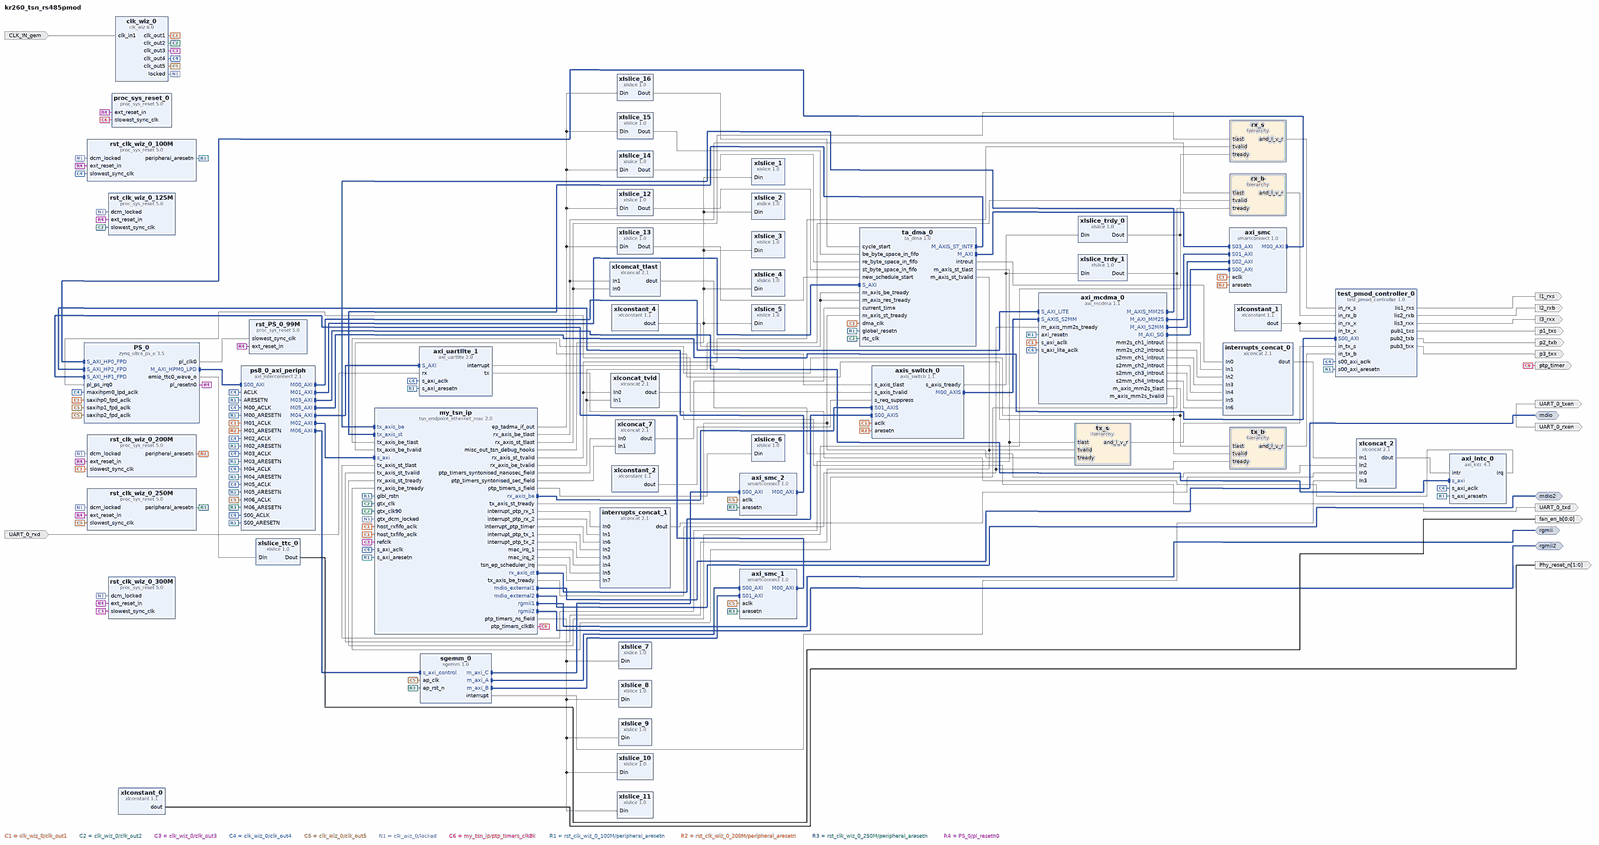
[diagram p0: block diagram of the top level, whole]
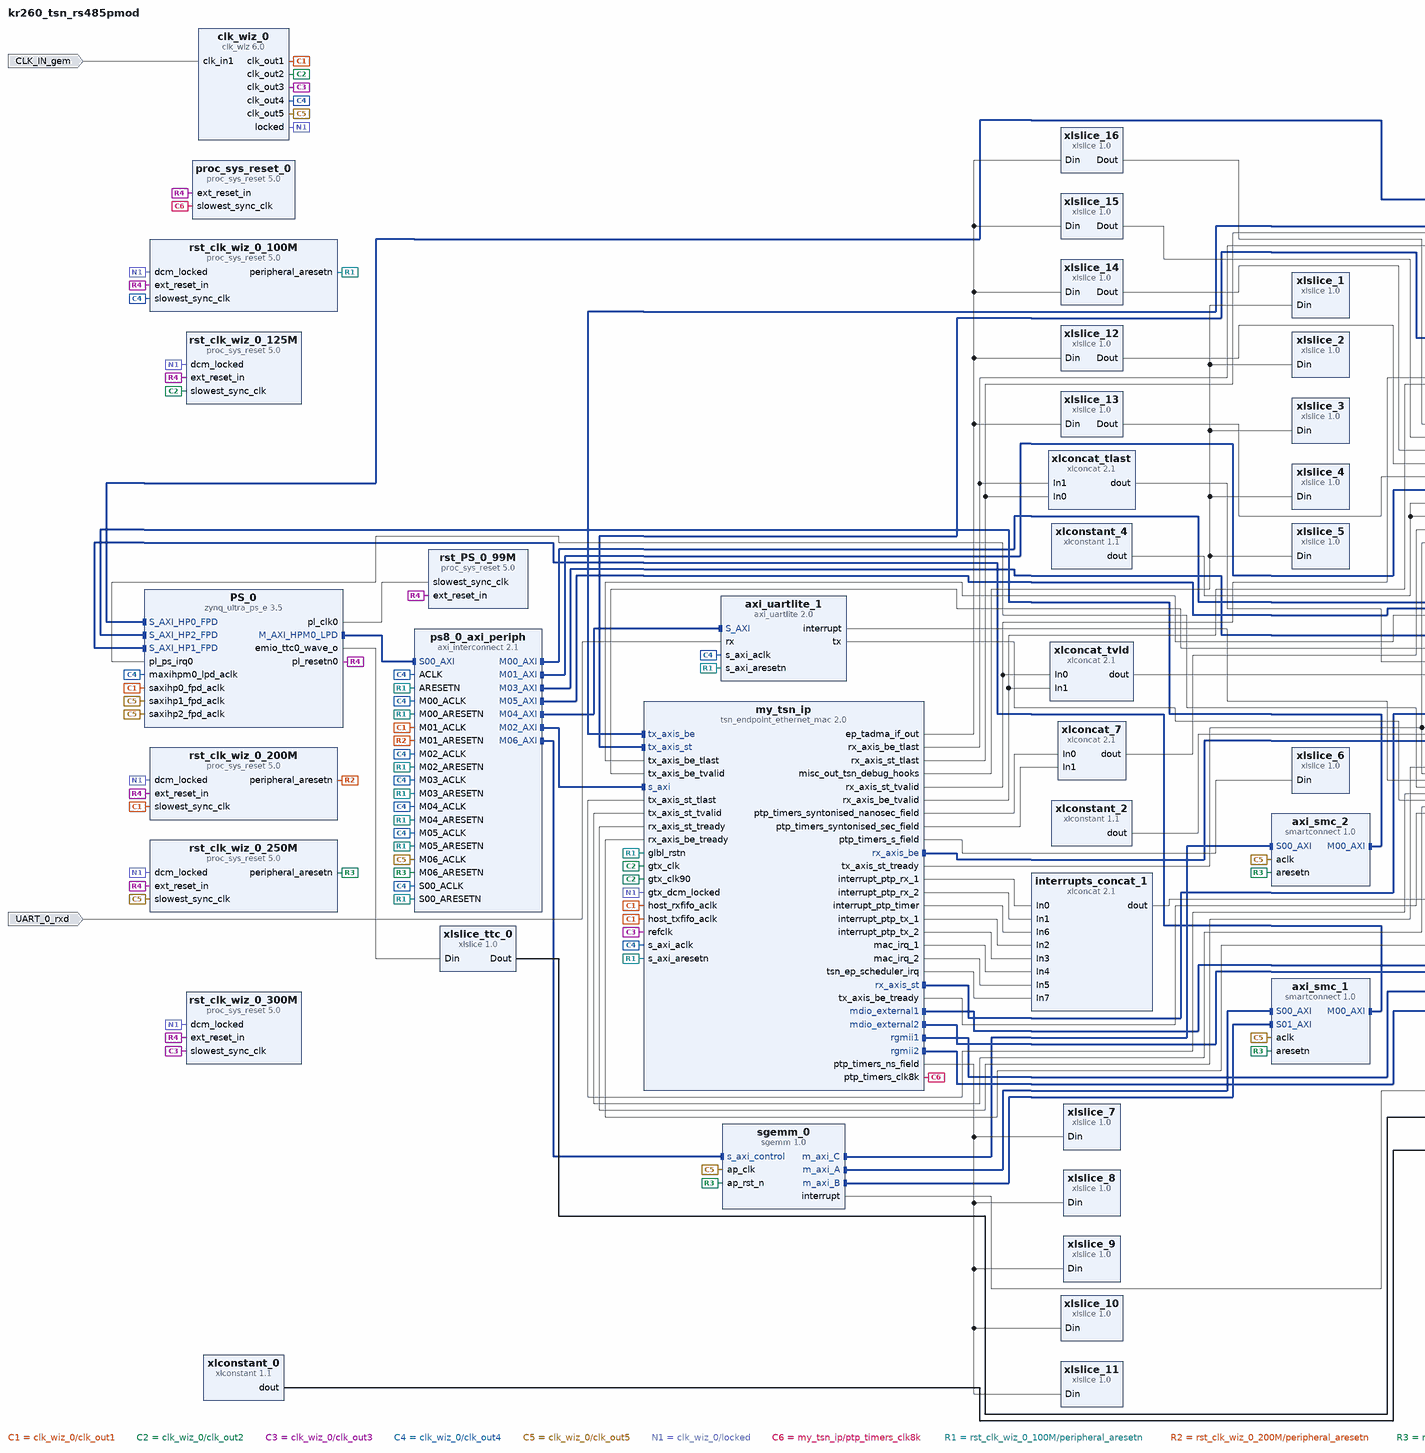
[diagram p1: block diagram of the top level, left part]
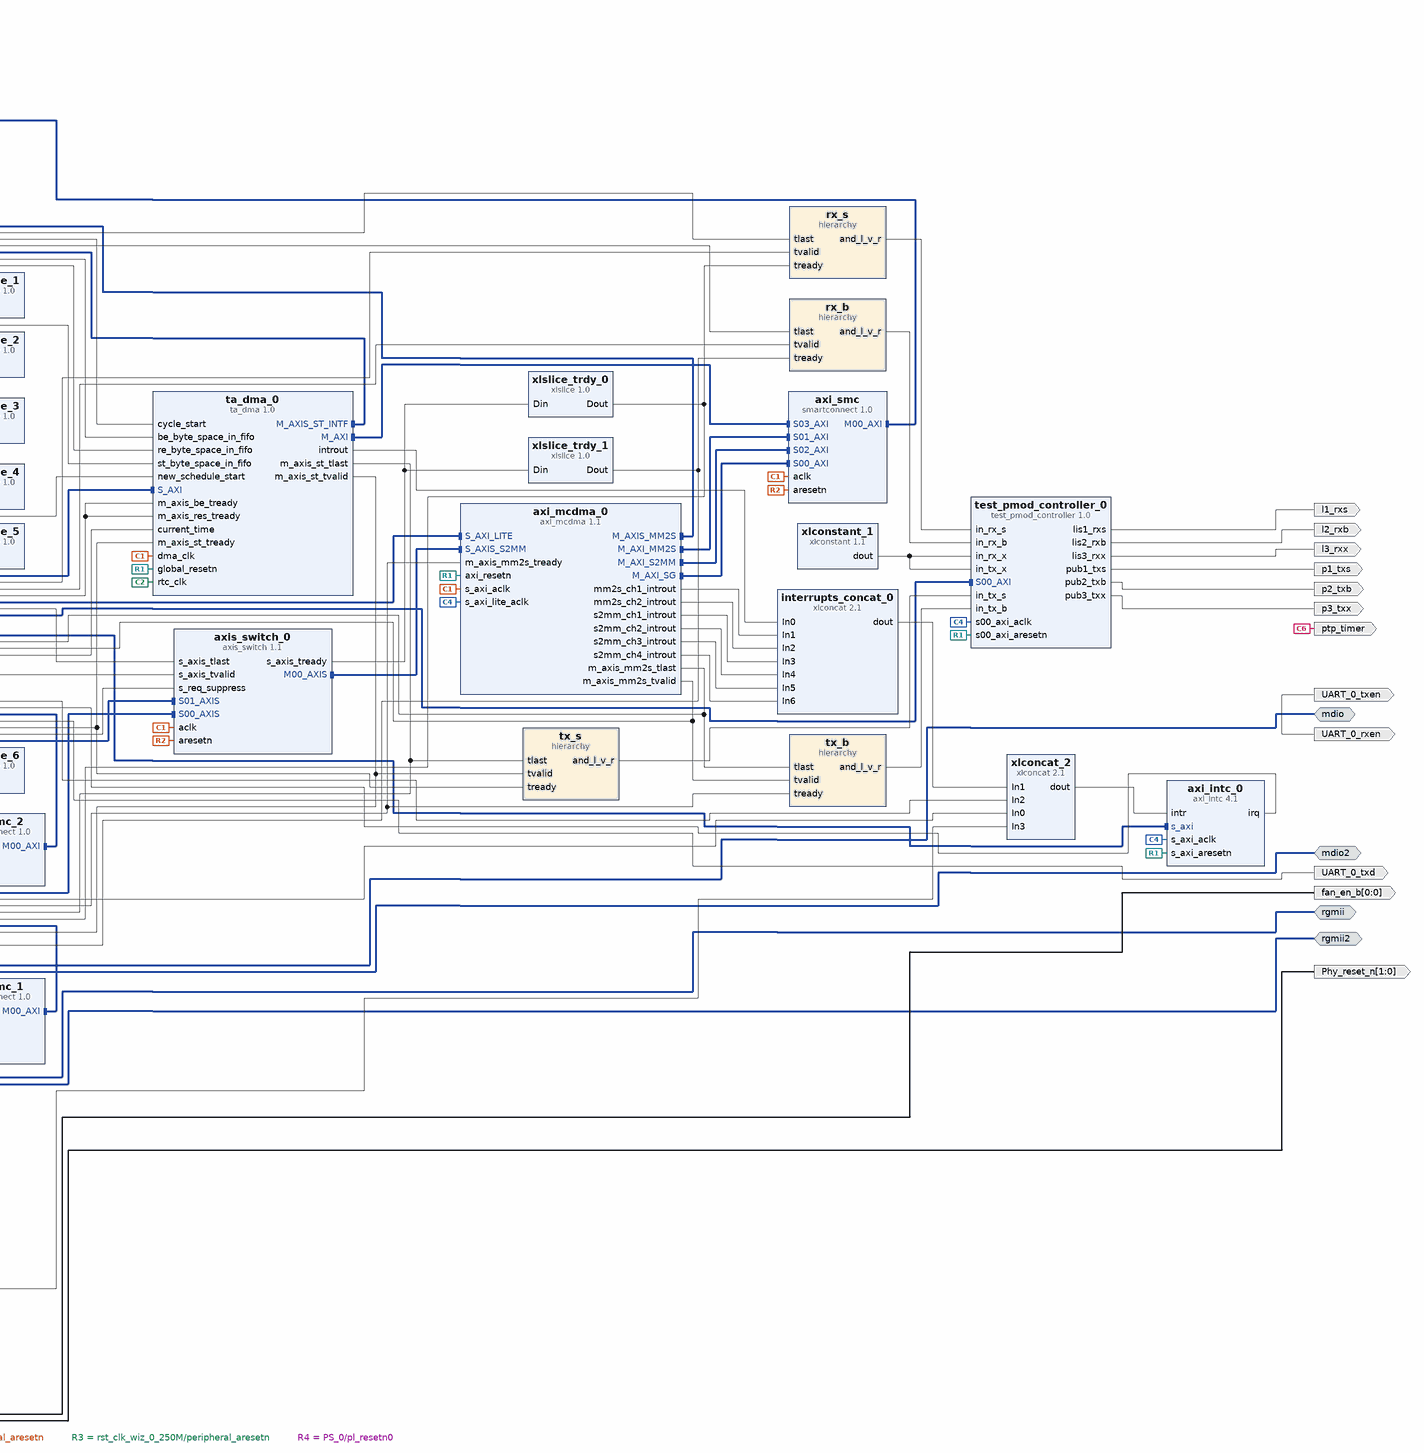
[diagram p2: block diagram of the top level, right part]
# Vivado block design kr260_tsn_rs485pmod, xck26-sfvc784-2LV-c, Vivado 2023.2
create_bd_design kr260_tsn_rs485pmod

create_bd_intf_port -mode Master -vlnv xilinx.com:interface:mdio_io:1.0 mdio
create_bd_intf_port -mode Master -vlnv xilinx.com:interface:mdio_io:1.0 mdio2
create_bd_intf_port -mode Master -vlnv xilinx.com:interface:rgmii_rtl:1.0 rgmii
create_bd_intf_port -mode Master -vlnv xilinx.com:interface:rgmii_rtl:1.0 rgmii2
create_bd_port -dir I -type clk CLK_IN_gem
set_property -dict {CONFIG.FREQ_HZ 25000000} [get_bd_ports CLK_IN_gem]
create_bd_port -dir O -from 1 -to 0 Phy_reset_n
create_bd_port -dir I UART_0_rxd
create_bd_port -dir O UART_0_rxen
create_bd_port -dir O UART_0_txd
create_bd_port -dir O UART_0_txen
create_bd_port -dir O -from 0 -to 0 fan_en_b
create_bd_port -dir O l1_rxs
create_bd_port -dir O l2_rxb
create_bd_port -dir O l3_rxx
create_bd_port -dir O p1_txs
create_bd_port -dir O p2_txb
create_bd_port -dir O p3_txx
create_bd_port -dir O ptp_timer

create_bd_cell -type ip -vlnv xilinx.com:ip:zynq_ultra_ps_e:3.5 PS_0
set_property -dict [list \
  CONFIG.CAN0_BOARD_INTERFACE custom \
  CONFIG.CAN1_BOARD_INTERFACE custom \
  CONFIG.CSU_BOARD_INTERFACE custom \
  CONFIG.DP_BOARD_INTERFACE custom \
  CONFIG.GEM0_BOARD_INTERFACE custom \
  CONFIG.GEM1_BOARD_INTERFACE custom \
  CONFIG.GEM2_BOARD_INTERFACE custom \
  CONFIG.GEM3_BOARD_INTERFACE custom \
  CONFIG.GPIO_BOARD_INTERFACE custom \
  CONFIG.IIC0_BOARD_INTERFACE custom \
  CONFIG.IIC1_BOARD_INTERFACE custom \
  CONFIG.NAND_BOARD_INTERFACE custom \
  CONFIG.PCIE_BOARD_INTERFACE custom \
  CONFIG.PJTAG_BOARD_INTERFACE custom \
  CONFIG.PMU_BOARD_INTERFACE custom \
  CONFIG.PSU_BANK_0_IO_STANDARD LVCMOS18 \
  CONFIG.PSU_BANK_1_IO_STANDARD LVCMOS18 \
  CONFIG.PSU_BANK_2_IO_STANDARD LVCMOS18 \
  CONFIG.PSU_BANK_3_IO_STANDARD LVCMOS18 \
  CONFIG.PSU_USB3__DUAL_CLOCK_ENABLE 1 \
  CONFIG.PSU__CAN1__PERIPHERAL__ENABLE 0 \
  CONFIG.PSU__CRF_APB__ACPU_CTRL__FREQMHZ 1333.333 \
  CONFIG.PSU__CRF_APB__ACPU_CTRL__SRCSEL APLL \
  CONFIG.PSU__CRF_APB__APLL_CTRL__SRCSEL PSS_REF_CLK \
  CONFIG.PSU__CRF_APB__APLL_FRAC_CFG__ENABLED 1 \
  CONFIG.PSU__CRF_APB__DBG_FPD_CTRL__FREQMHZ 250 \
  CONFIG.PSU__CRF_APB__DBG_FPD_CTRL__SRCSEL IOPLL \
  CONFIG.PSU__CRF_APB__DBG_TRACE_CTRL__FREQMHZ 250 \
  CONFIG.PSU__CRF_APB__DBG_TRACE_CTRL__SRCSEL IOPLL \
  CONFIG.PSU__CRF_APB__DBG_TSTMP_CTRL__FREQMHZ 250 \
  CONFIG.PSU__CRF_APB__DBG_TSTMP_CTRL__SRCSEL IOPLL \
  CONFIG.PSU__CRF_APB__DDR_CTRL__FREQMHZ 1200 \
  CONFIG.PSU__CRF_APB__DDR_CTRL__SRCSEL DPLL \
  CONFIG.PSU__CRF_APB__DPDMA_REF_CTRL__FREQMHZ 600 \
  CONFIG.PSU__CRF_APB__DPDMA_REF_CTRL__SRCSEL APLL \
  CONFIG.PSU__CRF_APB__DPLL_CTRL__SRCSEL PSS_REF_CLK \
  CONFIG.PSU__CRF_APB__DP_AUDIO_REF_CTRL__SRCSEL RPLL \
  CONFIG.PSU__CRF_APB__DP_STC_REF_CTRL__SRCSEL RPLL \
  CONFIG.PSU__CRF_APB__DP_VIDEO_REF_CTRL__SRCSEL VPLL \
  CONFIG.PSU__CRF_APB__GDMA_REF_CTRL__FREQMHZ 600 \
  CONFIG.PSU__CRF_APB__GDMA_REF_CTRL__SRCSEL DPLL \
  CONFIG.PSU__CRF_APB__GPU_REF_CTRL__FREQMHZ 600 \
  CONFIG.PSU__CRF_APB__GPU_REF_CTRL__SRCSEL IOPLL \
  CONFIG.PSU__CRF_APB__TOPSW_LSBUS_CTRL__FREQMHZ 100 \
  CONFIG.PSU__CRF_APB__TOPSW_LSBUS_CTRL__SRCSEL IOPLL \
  CONFIG.PSU__CRF_APB__TOPSW_MAIN_CTRL__FREQMHZ 533.33 \
  CONFIG.PSU__CRF_APB__TOPSW_MAIN_CTRL__SRCSEL DPLL \
  CONFIG.PSU__CRF_APB__VPLL_CTRL__SRCSEL PSS_REF_CLK \
  CONFIG.PSU__CRL_APB__ADMA_REF_CTRL__FREQMHZ 500 \
  CONFIG.PSU__CRL_APB__ADMA_REF_CTRL__SRCSEL IOPLL \
  CONFIG.PSU__CRL_APB__CAN1_REF_CTRL__FREQMHZ 100 \
  CONFIG.PSU__CRL_APB__CAN1_REF_CTRL__SRCSEL IOPLL \
  CONFIG.PSU__CRL_APB__CPU_R5_CTRL__FREQMHZ 533.333 \
  CONFIG.PSU__CRL_APB__CPU_R5_CTRL__SRCSEL RPLL \
  CONFIG.PSU__CRL_APB__DBG_LPD_CTRL__FREQMHZ 250 \
  CONFIG.PSU__CRL_APB__DBG_LPD_CTRL__SRCSEL IOPLL \
  CONFIG.PSU__CRL_APB__GEM3_REF_CTRL__FREQMHZ 125 \
  CONFIG.PSU__CRL_APB__GEM3_REF_CTRL__SRCSEL IOPLL \
  CONFIG.PSU__CRL_APB__I2C0_REF_CTRL__FREQMHZ 100 \
  CONFIG.PSU__CRL_APB__I2C0_REF_CTRL__SRCSEL IOPLL \
  CONFIG.PSU__CRL_APB__I2C1_REF_CTRL__FREQMHZ 100 \
  CONFIG.PSU__CRL_APB__I2C1_REF_CTRL__SRCSEL IOPLL \
  CONFIG.PSU__CRL_APB__IOPLL_CTRL__SRCSEL PSS_REF_CLK \
  CONFIG.PSU__CRL_APB__IOU_SWITCH_CTRL__FREQMHZ 250 \
  CONFIG.PSU__CRL_APB__IOU_SWITCH_CTRL__SRCSEL IOPLL \
  CONFIG.PSU__CRL_APB__LPD_LSBUS_CTRL__FREQMHZ 100 \
  CONFIG.PSU__CRL_APB__LPD_LSBUS_CTRL__SRCSEL IOPLL \
  CONFIG.PSU__CRL_APB__LPD_SWITCH_CTRL__FREQMHZ 500 \
  CONFIG.PSU__CRL_APB__LPD_SWITCH_CTRL__SRCSEL IOPLL \
  CONFIG.PSU__CRL_APB__PCAP_CTRL__FREQMHZ 200 \
  CONFIG.PSU__CRL_APB__PCAP_CTRL__SRCSEL IOPLL \
  CONFIG.PSU__CRL_APB__PL0_REF_CTRL__FREQMHZ 100 \
  CONFIG.PSU__CRL_APB__PL0_REF_CTRL__SRCSEL IOPLL \
  CONFIG.PSU__CRL_APB__PL1_REF_CTRL__FREQMHZ 250 \
  CONFIG.PSU__CRL_APB__PL1_REF_CTRL__SRCSEL IOPLL \
  CONFIG.PSU__CRL_APB__QSPI_REF_CTRL__FREQMHZ 125 \
  CONFIG.PSU__CRL_APB__QSPI_REF_CTRL__SRCSEL IOPLL \
  CONFIG.PSU__CRL_APB__RPLL_CTRL__SRCSEL PSS_REF_CLK \
  CONFIG.PSU__CRL_APB__SDIO1_REF_CTRL__FREQMHZ 200 \
  CONFIG.PSU__CRL_APB__SDIO1_REF_CTRL__SRCSEL RPLL \
  CONFIG.PSU__CRL_APB__SPI1_REF_CTRL__SRCSEL IOPLL \
  CONFIG.PSU__CRL_APB__TIMESTAMP_REF_CTRL__FREQMHZ 100 \
  CONFIG.PSU__CRL_APB__TIMESTAMP_REF_CTRL__SRCSEL IOPLL \
  CONFIG.PSU__CRL_APB__UART0_REF_CTRL__FREQMHZ 100 \
  CONFIG.PSU__CRL_APB__UART0_REF_CTRL__SRCSEL IOPLL \
  CONFIG.PSU__CRL_APB__UART1_REF_CTRL__FREQMHZ 100 \
  CONFIG.PSU__CRL_APB__UART1_REF_CTRL__SRCSEL IOPLL \
  CONFIG.PSU__CRL_APB__USB0_BUS_REF_CTRL__FREQMHZ 250 \
  CONFIG.PSU__CRL_APB__USB0_BUS_REF_CTRL__SRCSEL IOPLL \
  CONFIG.PSU__CRL_APB__USB3_DUAL_REF_CTRL__FREQMHZ 20 \
  CONFIG.PSU__CRL_APB__USB3_DUAL_REF_CTRL__SRCSEL IOPLL \
  CONFIG.PSU__CRL_APB__USB3__ENABLE 1 \
  CONFIG.PSU__CSUPMU__PERIPHERAL__VALID 1 \
  CONFIG.PSU__DDRC__BUS_WIDTH {64 Bit} \
  CONFIG.PSU__DDRC__COMPONENTS Components \
  CONFIG.PSU__DDRC__DEVICE_CAPACITY {8192 MBits} \
  CONFIG.PSU__DDRC__DRAM_WIDTH {16 Bits} \
  CONFIG.PSU__DDRC__ECC Disabled \
  CONFIG.PSU__DDRC__MEMORY_TYPE {DDR 4} \
  CONFIG.PSU__DDRC__SPEED_BIN DDR4_2400R \
  CONFIG.PSU__DDR_HIGH_ADDRESS_GUI_ENABLE 1 \
  CONFIG.PSU__DDR__INTERFACE__FREQMHZ 600.000 \
  CONFIG.PSU__DEVICE_TYPE EV \
  CONFIG.PSU__DISPLAYPORT__LANE0__ENABLE 1 \
  CONFIG.PSU__DISPLAYPORT__LANE0__IO {GT Lane1} \
  CONFIG.PSU__DISPLAYPORT__LANE1__ENABLE 0 \
  CONFIG.PSU__DISPLAYPORT__PERIPHERAL__ENABLE 1 \
  CONFIG.PSU__DLL__ISUSED 0 \
  CONFIG.PSU__DPAUX__PERIPHERAL__ENABLE 1 \
  CONFIG.PSU__DPAUX__PERIPHERAL__IO {MIO 27 .. 30} \
  CONFIG.PSU__DP__LANE_SEL {Single Lower} \
  CONFIG.PSU__DP__REF_CLK_FREQ 27 \
  CONFIG.PSU__DP__REF_CLK_SEL {Ref Clk1} \
  CONFIG.PSU__ENET0__PERIPHERAL__ENABLE 1 \
  CONFIG.PSU__ENET0__PERIPHERAL__IO {GT Lane0} \
  CONFIG.PSU__ENET1__GRP_MDIO__ENABLE 1 \
  CONFIG.PSU__ENET1__GRP_MDIO__IO {MIO 50 .. 51} \
  CONFIG.PSU__ENET1__PERIPHERAL__ENABLE 1 \
  CONFIG.PSU__ENET1__PERIPHERAL__IO {MIO 38 .. 49} \
  CONFIG.PSU__ENET3__PERIPHERAL__ENABLE 0 \
  CONFIG.PSU__FPGA_PL0_ENABLE 1 \
  CONFIG.PSU__FPGA_PL1_ENABLE 1 \
  CONFIG.PSU__GEM0__REF_CLK_FREQ 125 \
  CONFIG.PSU__GEM0__REF_CLK_SEL {Ref Clk0} \
  CONFIG.PSU__GEM__TSU__ENABLE 0 \
  CONFIG.PSU__GPIO0_MIO__IO {MIO 0 .. 25} \
  CONFIG.PSU__GPIO0_MIO__PERIPHERAL__ENABLE 1 \
  CONFIG.PSU__GPIO1_MIO__IO {MIO 26 .. 51} \
  CONFIG.PSU__GPIO1_MIO__PERIPHERAL__ENABLE 1 \
  CONFIG.PSU__GT__LINK_SPEED HBR \
  CONFIG.PSU__GT__PRE_EMPH_LVL_4 0 \
  CONFIG.PSU__GT__VLT_SWNG_LVL_4 0 \
  CONFIG.PSU__I2C0__PERIPHERAL__ENABLE 0 \
  CONFIG.PSU__I2C1__PERIPHERAL__ENABLE 1 \
  CONFIG.PSU__I2C1__PERIPHERAL__IO {MIO 24 .. 25} \
  CONFIG.PSU__IOU_SLCR__IOU_TTC_APB_CLK__TTC0_SEL APB \
  CONFIG.PSU__IOU_SLCR__IOU_TTC_APB_CLK__TTC1_SEL APB \
  CONFIG.PSU__IOU_SLCR__IOU_TTC_APB_CLK__TTC2_SEL APB \
  CONFIG.PSU__IOU_SLCR__IOU_TTC_APB_CLK__TTC3_SEL APB \
  CONFIG.PSU__OVERRIDE_HPX_QOS 0 \
  CONFIG.PSU__OVERRIDE__BASIC_CLOCK 0 \
  CONFIG.PSU__PMU_COHERENCY 0 \
  CONFIG.PSU__PMU__AIBACK__ENABLE 0 \
  CONFIG.PSU__PMU__EMIO_GPI__ENABLE 0 \
  CONFIG.PSU__PMU__EMIO_GPO__ENABLE 0 \
  CONFIG.PSU__PMU__GPI0__ENABLE 1 \
  CONFIG.PSU__PMU__GPI0__IO {MIO 26} \
  CONFIG.PSU__PMU__GPI1__ENABLE 0 \
  CONFIG.PSU__PMU__GPI2__ENABLE 0 \
  CONFIG.PSU__PMU__GPI3__ENABLE 0 \
  CONFIG.PSU__PMU__GPI4__ENABLE 0 \
  CONFIG.PSU__PMU__GPI5__ENABLE 1 \
  CONFIG.PSU__PMU__GPI5__IO {MIO 31} \
  CONFIG.PSU__PMU__GPO0__ENABLE 0 \
  CONFIG.PSU__PMU__GPO1__ENABLE 0 \
  CONFIG.PSU__PMU__GPO2__ENABLE 0 \
  CONFIG.PSU__PMU__GPO3__ENABLE 1 \
  CONFIG.PSU__PMU__GPO3__IO {MIO 35} \
  CONFIG.PSU__PMU__GPO3__POLARITY low \
  CONFIG.PSU__PMU__GPO4__ENABLE 0 \
  CONFIG.PSU__PMU__GPO5__ENABLE 0 \
  CONFIG.PSU__PMU__PERIPHERAL__ENABLE 1 \
  CONFIG.PSU__PMU__PLERROR__ENABLE 0 \
  CONFIG.PSU__PRESET_APPLIED 1 \
  CONFIG.PSU__PSS_REF_CLK__FREQMHZ 33.333 \
  CONFIG.PSU__QSPI_COHERENCY 0 \
  CONFIG.PSU__QSPI_ROUTE_THROUGH_FPD 0 \
  CONFIG.PSU__QSPI__GRP_FBCLK__ENABLE 0 \
  CONFIG.PSU__QSPI__PERIPHERAL__DATA_MODE x4 \
  CONFIG.PSU__QSPI__PERIPHERAL__ENABLE 1 \
  CONFIG.PSU__QSPI__PERIPHERAL__IO {MIO 0 .. 5} \
  CONFIG.PSU__QSPI__PERIPHERAL__MODE Single \
  CONFIG.PSU__SATA__PERIPHERAL__ENABLE 0 \
  CONFIG.PSU__SD0__CLK_100_SDR_OTAP_DLY 0x3 \
  CONFIG.PSU__SD0__CLK_200_SDR_OTAP_DLY 0x3 \
  CONFIG.PSU__SD0__CLK_50_DDR_ITAP_DLY 0x3D \
  CONFIG.PSU__SD0__CLK_50_DDR_OTAP_DLY 0x4 \
  CONFIG.PSU__SD0__CLK_50_SDR_ITAP_DLY 0x15 \
  CONFIG.PSU__SD0__CLK_50_SDR_OTAP_DLY 0x5 \
  CONFIG.PSU__SD1__CLK_100_SDR_OTAP_DLY 0x00 \
  CONFIG.PSU__SD1__CLK_200_SDR_OTAP_DLY 0x00 \
  CONFIG.PSU__SD1__CLK_50_DDR_ITAP_DLY 0x00 \
  CONFIG.PSU__SD1__CLK_50_DDR_OTAP_DLY 0x00 \
  CONFIG.PSU__SD1__CLK_50_SDR_ITAP_DLY 0x00 \
  CONFIG.PSU__SD1__CLK_50_SDR_OTAP_DLY 0x00 \
  CONFIG.PSU__SD1__PERIPHERAL__ENABLE 0 \
  CONFIG.PSU__SPI1__GRP_SS0__IO {MIO 9} \
  CONFIG.PSU__SPI1__PERIPHERAL__ENABLE 1 \
  CONFIG.PSU__SPI1__PERIPHERAL__IO {MIO 6 .. 11} \
  CONFIG.PSU__SWDT0__CLOCK__ENABLE 0 \
  CONFIG.PSU__SWDT0__PERIPHERAL__ENABLE 1 \
  CONFIG.PSU__SWDT0__RESET__ENABLE 0 \
  CONFIG.PSU__SWDT1__CLOCK__ENABLE 0 \
  CONFIG.PSU__SWDT1__PERIPHERAL__ENABLE 1 \
  CONFIG.PSU__SWDT1__RESET__ENABLE 0 \
  CONFIG.PSU__TSU__BUFG_PORT_PAIR 0 \
  CONFIG.PSU__TTC0__CLOCK__ENABLE 0 \
  CONFIG.PSU__TTC0__PERIPHERAL__ENABLE 1 \
  CONFIG.PSU__TTC0__WAVEOUT__ENABLE 1 \
  CONFIG.PSU__TTC0__WAVEOUT__IO EMIO \
  CONFIG.PSU__TTC1__CLOCK__ENABLE 0 \
  CONFIG.PSU__TTC1__PERIPHERAL__ENABLE 1 \
  CONFIG.PSU__TTC1__WAVEOUT__ENABLE 0 \
  CONFIG.PSU__TTC2__CLOCK__ENABLE 0 \
  CONFIG.PSU__TTC2__PERIPHERAL__ENABLE 1 \
  CONFIG.PSU__TTC2__WAVEOUT__ENABLE 0 \
  CONFIG.PSU__TTC3__CLOCK__ENABLE 0 \
  CONFIG.PSU__TTC3__PERIPHERAL__ENABLE 1 \
  CONFIG.PSU__TTC3__WAVEOUT__ENABLE 0 \
  CONFIG.PSU__UART0__PERIPHERAL__ENABLE 0 \
  CONFIG.PSU__UART1__BAUD_RATE 115200 \
  CONFIG.PSU__UART1__MODEM__ENABLE 0 \
  CONFIG.PSU__UART1__PERIPHERAL__ENABLE 1 \
  CONFIG.PSU__UART1__PERIPHERAL__IO {MIO 36 .. 37} \
  CONFIG.PSU__USB0_COHERENCY 0 \
  CONFIG.PSU__USB0__PERIPHERAL__ENABLE 1 \
  CONFIG.PSU__USB0__PERIPHERAL__IO {MIO 52 .. 63} \
  CONFIG.PSU__USB0__REF_CLK_FREQ 26 \
  CONFIG.PSU__USB0__REF_CLK_SEL {Ref Clk2} \
  CONFIG.PSU__USB0__RESET__ENABLE 1 \
  CONFIG.PSU__USB0__RESET__IO {MIO 76} \
  CONFIG.PSU__USB1__PERIPHERAL__ENABLE 1 \
  CONFIG.PSU__USB1__PERIPHERAL__IO {MIO 64 .. 75} \
  CONFIG.PSU__USB1__REF_CLK_FREQ 26 \
  CONFIG.PSU__USB1__REF_CLK_SEL {Ref Clk3} \
  CONFIG.PSU__USB1__RESET__ENABLE 1 \
  CONFIG.PSU__USB1__RESET__IO {MIO 77} \
  CONFIG.PSU__USB2_0__EMIO__ENABLE 0 \
  CONFIG.PSU__USB3_0__EMIO__ENABLE 0 \
  CONFIG.PSU__USB3_0__PERIPHERAL__ENABLE 1 \
  CONFIG.PSU__USB3_0__PERIPHERAL__IO {GT Lane2} \
  CONFIG.PSU__USB3_1__PERIPHERAL__ENABLE 1 \
  CONFIG.PSU__USB3_1__PERIPHERAL__IO {GT Lane3} \
  CONFIG.PSU__USB__RESET__MODE {Separate MIO Pin} \
  CONFIG.PSU__USB__RESET__POLARITY {Active Low} \
  CONFIG.PSU__USE__IRQ0 1 \
  CONFIG.PSU__USE__IRQ1 1 \
  CONFIG.PSU__USE__M_AXI_GP0 0 \
  CONFIG.PSU__USE__M_AXI_GP1 0 \
  CONFIG.PSU__USE__M_AXI_GP2 1 \
  CONFIG.PSU__USE__S_AXI_GP2 1 \
  CONFIG.PSU__USE__S_AXI_GP3 1 \
  CONFIG.PSU__USE__S_AXI_GP4 1 \
  CONFIG.QSPI_BOARD_INTERFACE custom \
  CONFIG.SATA_BOARD_INTERFACE custom \
  CONFIG.SD0_BOARD_INTERFACE custom \
  CONFIG.SD1_BOARD_INTERFACE custom \
  CONFIG.SPI0_BOARD_INTERFACE custom \
  CONFIG.SPI1_BOARD_INTERFACE custom \
  CONFIG.SUBPRESET1 Custom \
  CONFIG.SUBPRESET2 Custom \
  CONFIG.SWDT0_BOARD_INTERFACE custom \
  CONFIG.SWDT1_BOARD_INTERFACE custom \
  CONFIG.TRACE_BOARD_INTERFACE custom \
  CONFIG.TTC0_BOARD_INTERFACE custom \
  CONFIG.TTC1_BOARD_INTERFACE custom \
  CONFIG.TTC2_BOARD_INTERFACE custom \
  CONFIG.TTC3_BOARD_INTERFACE custom \
  CONFIG.UART0_BOARD_INTERFACE custom \
  CONFIG.UART1_BOARD_INTERFACE custom \
  CONFIG.USB0_BOARD_INTERFACE custom \
  CONFIG.USB1_BOARD_INTERFACE custom \
] [get_bd_cells PS_0]
# 749 more settings of PS_0 are not shown: defaults, MIO pin electricals, DDR timing, and values the tool derives
create_bd_cell -type ip -vlnv xilinx.com:ip:axi_intc:4.1 axi_intc_0
set_property -dict {CONFIG.C_CASCADE_MASTER 1 CONFIG.C_EN_CASCADE_MODE 0 CONFIG.C_IRQ_CONNECTION 1} [get_bd_cells axi_intc_0]
create_bd_cell -type ip -vlnv xilinx.com:ip:axi_mcdma:1.1 axi_mcdma_0
set_property -dict [list \
  CONFIG.c_addr_width 32 \
  CONFIG.c_group1_mm2s 0000000000000011 \
  CONFIG.c_group1_s2mm 0000000000001111 \
  CONFIG.c_include_mm2s 1 \
  CONFIG.c_include_mm2s_dre 1 \
  CONFIG.c_include_s2mm_dre 1 \
  CONFIG.c_mm2s_scheduler 0 \
  CONFIG.c_num_mm2s_channels 2 \
  CONFIG.c_num_s2mm_channels 4 \
] [get_bd_cells axi_mcdma_0]
create_bd_cell -type ip -vlnv xilinx.com:ip:smartconnect:1.0 axi_smc
set_property -dict {CONFIG.NUM_SI 4} [get_bd_cells axi_smc]
create_bd_cell -type ip -vlnv xilinx.com:ip:axis_switch:1.1 axis_switch_0
set_property -dict [list \
  CONFIG.ARB_ALGORITHM 1 \
  CONFIG.ARB_ON_TLAST 1 \
  CONFIG.HAS_TKEEP 1 \
  CONFIG.HAS_TLAST 1 \
  CONFIG.M00_AXIS_HIGHTDEST 0x00000006 \
  CONFIG.NUM_SI 2 \
  CONFIG.ROUTING_MODE 0 \
  CONFIG.TDATA_NUM_BYTES 4 \
  CONFIG.TDEST_WIDTH 3 \
  CONFIG.TUSER_WIDTH 32 \
] [get_bd_cells axis_switch_0]
create_bd_cell -type ip -vlnv xilinx.com:ip:clk_wiz:6.0 clk_wiz_0
set_property -dict [list \
  CONFIG.CLKIN1_JITTER_PS 400.0 \
  CONFIG.CLKOUT1_JITTER 141.764 \
  CONFIG.CLKOUT1_PHASE_ERROR 222.521 \
  CONFIG.CLKOUT1_REQUESTED_OUT_FREQ 200.000 \
  CONFIG.CLKOUT2_JITTER 148.988 \
  CONFIG.CLKOUT2_PHASE_ERROR 222.521 \
  CONFIG.CLKOUT2_REQUESTED_OUT_FREQ 125.000 \
  CONFIG.CLKOUT2_USED true \
  CONFIG.CLKOUT3_JITTER 135.994 \
  CONFIG.CLKOUT3_PHASE_ERROR 222.521 \
  CONFIG.CLKOUT3_REQUESTED_OUT_FREQ 300.000 \
  CONFIG.CLKOUT3_USED true \
  CONFIG.CLKOUT4_JITTER 152.629 \
  CONFIG.CLKOUT4_PHASE_ERROR 222.521 \
  CONFIG.CLKOUT4_REQUESTED_OUT_FREQ 100.000 \
  CONFIG.CLKOUT4_USED true \
  CONFIG.CLKOUT5_JITTER 138.537 \
  CONFIG.CLKOUT5_PHASE_ERROR 222.521 \
  CONFIG.CLKOUT5_REQUESTED_OUT_FREQ 250 \
  CONFIG.CLKOUT5_USED true \
  CONFIG.MMCM_CLKFBOUT_MULT_F 60.000 \
  CONFIG.MMCM_CLKIN1_PERIOD 40.000 \
  CONFIG.MMCM_CLKIN2_PERIOD 10.0 \
  CONFIG.MMCM_CLKOUT0_DIVIDE_F 7.500 \
  CONFIG.MMCM_CLKOUT1_DIVIDE 12 \
  CONFIG.MMCM_CLKOUT2_DIVIDE 5 \
  CONFIG.MMCM_CLKOUT3_DIVIDE 15 \
  CONFIG.MMCM_CLKOUT4_DIVIDE 6 \
  CONFIG.MMCM_DIVCLK_DIVIDE 1 \
  CONFIG.NUM_OUT_CLKS 5 \
  CONFIG.PRIM_IN_FREQ 25 \
  CONFIG.PRIM_SOURCE Single_ended_clock_capable_pin \
  CONFIG.USE_BOARD_FLOW true \
  CONFIG.USE_RESET false \
] [get_bd_cells clk_wiz_0]
create_bd_cell -type ip -vlnv xilinx.com:ip:xlconcat:2.1 interrupts_concat_0
set_property -dict {CONFIG.NUM_PORTS 7 CONFIG.dout_width 7} [get_bd_cells interrupts_concat_0]
create_bd_cell -type ip -vlnv xilinx.com:ip:xlconcat:2.1 interrupts_concat_1
set_property -dict {CONFIG.NUM_PORTS 8 CONFIG.dout_width 8} [get_bd_cells interrupts_concat_1]
create_bd_cell -type ip -vlnv xilinx.com:ip:tsn_endpoint_ethernet_mac:2.0 my_tsn_ip
set_property -dict [list \
  CONFIG.ADDR_TRANSLATION_TYPE false \
  CONFIG.ENABLE_EP_TADMA_INTERFACE true \
  CONFIG.EN_CB_RSVD_BYTES true \
  CONFIG.EN_COMMON_STATS false \
  CONFIG.EN_FRAME_PREEMPTION_SUPPORT true \
  CONFIG.EN_FRAME_PREEMPTION_SUPPORT_MAC_2 true \
  CONFIG.EN_FRER true \
  CONFIG.EN_HW_ADDR_LEARNING true \
  CONFIG.EN_MDIO_IO_BUF true \
  CONFIG.EN_PERVLAN_AGING_TIME 1 \
  CONFIG.EN_PER_PRIQ_CNFGS false \
  CONFIG.EN_PSFP true \
  CONFIG.EN_RX_CUSTOM_TIMESTAMP true \
  CONFIG.EN_TX_CUSTOM_TIMESTAMP true \
  CONFIG.MAX_LEARNING_ENTRIES 256 \
  CONFIG.PHYSICAL_INTERFACE RGMII \
  CONFIG.STORE_AND_FORWARD 1 \
  CONFIG.TSN_EP_Switch 1 \
  CONFIG.USE_HARD_FIFO 2 \
] [get_bd_cells my_tsn_ip]
create_bd_cell -type ip -vlnv xilinx.com:ip:proc_sys_reset:5.0 proc_sys_reset_0
create_bd_cell -type ip -vlnv xilinx.com:ip:axi_interconnect:2.1 ps8_0_axi_periph
set_property -dict {CONFIG.M01_HAS_REGSLICE 3 CONFIG.NUM_MI 7} [get_bd_cells ps8_0_axi_periph]
create_bd_cell -type ip -vlnv user.org:user:test_pmod_controller:1.0 test_pmod_controller_0
create_bd_cell -type ip -vlnv xilinx.com:ip:proc_sys_reset:5.0 rst_clk_wiz_0_100M
create_bd_cell -type ip -vlnv xilinx.com:ip:proc_sys_reset:5.0 rst_clk_wiz_0_125M
create_bd_cell -type ip -vlnv xilinx.com:ip:proc_sys_reset:5.0 rst_clk_wiz_0_200M
create_bd_cell -type ip -vlnv xilinx.com:ip:proc_sys_reset:5.0 rst_clk_wiz_0_300M
create_bd_cell -type hier rx_b
create_bd_cell -type hier rx_s
create_bd_cell -type ip -vlnv xilinx.com:ip:ta_dma:1.0 ta_dma_0
set_property -dict {CONFIG.C_NUM_BUFFERS_PER_STREAM 8} [get_bd_cells ta_dma_0]
create_bd_cell -type hier tx_b
create_bd_cell -type hier tx_s
create_bd_cell -type ip -vlnv xilinx.com:ip:xlconcat:2.1 xlconcat_2
set_property -dict {CONFIG.NUM_PORTS 4 CONFIG.dout_width 17} [get_bd_cells xlconcat_2]
create_bd_cell -type ip -vlnv xilinx.com:ip:xlconcat:2.1 xlconcat_7
set_property -dict {CONFIG.IN0_WIDTH 32 CONFIG.IN1_WIDTH 48 CONFIG.dout_width 80} [get_bd_cells xlconcat_7]
create_bd_cell -type ip -vlnv xilinx.com:ip:xlconcat:2.1 xlconcat_tlast
create_bd_cell -type ip -vlnv xilinx.com:ip:xlconcat:2.1 xlconcat_tvld
create_bd_cell -type ip -vlnv xilinx.com:ip:xlconstant:1.1 xlconstant_0
set_property -dict {CONFIG.CONST_VAL 3 CONFIG.CONST_WIDTH 2} [get_bd_cells xlconstant_0]
create_bd_cell -type ip -vlnv xilinx.com:ip:xlconstant:1.1 xlconstant_1
create_bd_cell -type ip -vlnv xilinx.com:ip:xlconstant:1.1 xlconstant_2
set_property -dict {CONFIG.CONST_VAL 0 CONFIG.CONST_WIDTH 2} [get_bd_cells xlconstant_2]
create_bd_cell -type ip -vlnv xilinx.com:ip:xlconstant:1.1 xlconstant_4
create_bd_cell -type ip -vlnv xilinx.com:ip:xlslice:1.0 xlslice_1
set_property -dict {CONFIG.DIN_FROM 138 CONFIG.DIN_TO 136 CONFIG.DIN_WIDTH 512 CONFIG.DOUT_WIDTH 1} [get_bd_cells xlslice_1]
create_bd_cell -type ip -vlnv xilinx.com:ip:xlslice:1.0 xlslice_2
set_property -dict {CONFIG.DIN_FROM 146 CONFIG.DIN_TO 144 CONFIG.DIN_WIDTH 512 CONFIG.DOUT_WIDTH 1} [get_bd_cells xlslice_2]
create_bd_cell -type ip -vlnv xilinx.com:ip:xlslice:1.0 xlslice_3
set_property -dict {CONFIG.DIN_FROM 154 CONFIG.DIN_TO 152 CONFIG.DIN_WIDTH 512 CONFIG.DOUT_WIDTH 1} [get_bd_cells xlslice_3]
create_bd_cell -type ip -vlnv xilinx.com:ip:xlslice:1.0 xlslice_4
set_property -dict {CONFIG.DIN_FROM 161 CONFIG.DIN_TO 160 CONFIG.DIN_WIDTH 512 CONFIG.DOUT_WIDTH 1} [get_bd_cells xlslice_4]
create_bd_cell -type ip -vlnv xilinx.com:ip:xlslice:1.0 xlslice_5
set_property -dict {CONFIG.DIN_FROM 193 CONFIG.DIN_TO 192 CONFIG.DIN_WIDTH 512 CONFIG.DOUT_WIDTH 1} [get_bd_cells xlslice_5]
create_bd_cell -type ip -vlnv xilinx.com:ip:xlslice:1.0 xlslice_6
set_property -dict {CONFIG.DIN_FROM 0 CONFIG.DIN_TO 0 CONFIG.DIN_WIDTH 48 CONFIG.DOUT_WIDTH 1} [get_bd_cells xlslice_6]
create_bd_cell -type ip -vlnv xilinx.com:ip:xlslice:1.0 xlslice_7
set_property -dict {CONFIG.DIN_FROM 9 CONFIG.DIN_TO 9 CONFIG.DIN_WIDTH 32 CONFIG.DOUT_WIDTH 1} [get_bd_cells xlslice_7]
create_bd_cell -type ip -vlnv xilinx.com:ip:xlslice:1.0 xlslice_8
set_property -dict {CONFIG.DIN_FROM 19 CONFIG.DIN_TO 19 CONFIG.DIN_WIDTH 32 CONFIG.DOUT_WIDTH 1} [get_bd_cells xlslice_8]
create_bd_cell -type ip -vlnv xilinx.com:ip:xlslice:1.0 xlslice_9
set_property -dict {CONFIG.DIN_FROM 21 CONFIG.DIN_TO 21 CONFIG.DIN_WIDTH 32 CONFIG.DOUT_WIDTH 1} [get_bd_cells xlslice_9]
create_bd_cell -type ip -vlnv xilinx.com:ip:xlslice:1.0 xlslice_10
set_property -dict {CONFIG.DIN_FROM 14 CONFIG.DIN_TO 14 CONFIG.DIN_WIDTH 32 CONFIG.DOUT_WIDTH 1} [get_bd_cells xlslice_10]
create_bd_cell -type ip -vlnv xilinx.com:ip:xlslice:1.0 xlslice_11
set_property -dict {CONFIG.DIN_FROM 8 CONFIG.DIN_TO 0 CONFIG.DIN_WIDTH 32 CONFIG.DOUT_WIDTH 9} [get_bd_cells xlslice_11]
create_bd_cell -type ip -vlnv xilinx.com:ip:xlslice:1.0 xlslice_12
set_property -dict {CONFIG.DIN_FROM 15 CONFIG.DIN_TO 0 CONFIG.DIN_WIDTH 64 CONFIG.DOUT_WIDTH 16} [get_bd_cells xlslice_12]
create_bd_cell -type ip -vlnv xilinx.com:ip:xlslice:1.0 xlslice_13
set_property -dict {CONFIG.DIN_FROM 63 CONFIG.DIN_TO 63 CONFIG.DIN_WIDTH 64 CONFIG.DOUT_WIDTH 1} [get_bd_cells xlslice_13]
create_bd_cell -type ip -vlnv xilinx.com:ip:xlslice:1.0 xlslice_14
set_property -dict {CONFIG.DIN_FROM 31 CONFIG.DIN_TO 16 CONFIG.DIN_WIDTH 64 CONFIG.DOUT_WIDTH 16} [get_bd_cells xlslice_14]
create_bd_cell -type ip -vlnv xilinx.com:ip:xlslice:1.0 xlslice_15
set_property -dict {CONFIG.DIN_FROM 47 CONFIG.DIN_TO 32 CONFIG.DIN_WIDTH 64 CONFIG.DOUT_WIDTH 1} [get_bd_cells xlslice_15]
create_bd_cell -type ip -vlnv xilinx.com:ip:xlslice:1.0 xlslice_16
set_property -dict {CONFIG.DIN_FROM 62 CONFIG.DIN_TO 62 CONFIG.DIN_WIDTH 64 CONFIG.DOUT_WIDTH 1} [get_bd_cells xlslice_16]
create_bd_cell -type ip -vlnv xilinx.com:ip:xlslice:1.0 xlslice_trdy_0
set_property -dict {CONFIG.DIN_WIDTH 2} [get_bd_cells xlslice_trdy_0]
create_bd_cell -type ip -vlnv xilinx.com:ip:xlslice:1.0 xlslice_trdy_1
set_property -dict {CONFIG.DIN_FROM 1 CONFIG.DIN_TO 1 CONFIG.DIN_WIDTH 2 CONFIG.DOUT_WIDTH 1} [get_bd_cells xlslice_trdy_1]
create_bd_cell -type ip -vlnv xilinx.com:ip:xlslice:1.0 xlslice_ttc_0
set_property -dict {CONFIG.DIN_FROM 2 CONFIG.DIN_TO 2 CONFIG.DIN_WIDTH 3 CONFIG.DOUT_WIDTH 1} [get_bd_cells xlslice_ttc_0]
create_bd_cell -type ip -vlnv xilinx.com:ip:proc_sys_reset:5.0 rst_clk_wiz_0_250M
set_property -dict {CONFIG.RESET_BOARD_INTERFACE Custom CONFIG.USE_BOARD_FLOW true} [get_bd_cells rst_clk_wiz_0_250M]
create_bd_cell -type ip -vlnv xilinx.com:ip:axi_uartlite:2.0 axi_uartlite_1
create_bd_cell -type ip -vlnv xilinx.com:ip:proc_sys_reset:5.0 rst_PS_0_99M
create_bd_cell -type ip -vlnv xilinx.com:hls:sgemm:1.0 sgemm_0
create_bd_cell -type ip -vlnv xilinx.com:ip:smartconnect:1.0 axi_smc_1
set_property -dict {CONFIG.NUM_CLKS 1 CONFIG.NUM_SI 2} [get_bd_cells axi_smc_1]
create_bd_cell -type ip -vlnv xilinx.com:ip:smartconnect:1.0 axi_smc_2
set_property -dict {CONFIG.NUM_CLKS 1 CONFIG.NUM_SI 1} [get_bd_cells axi_smc_2]

# ---- hierarchy /rx_b ----
current_bd_instance /rx_b
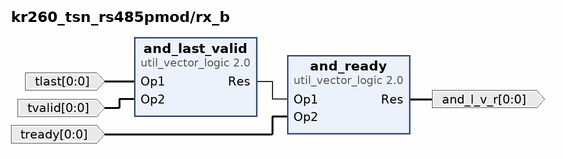
[diagram p3: block diagram inside /rx_b]
create_bd_pin -dir O -from 0 -to 0 and_l_v_r
create_bd_pin -dir I -from 0 -to 0 tlast
create_bd_pin -dir I -from 0 -to 0 tready
create_bd_pin -dir I -from 0 -to 0 tvalid

create_bd_cell -type ip -vlnv xilinx.com:ip:util_vector_logic:2.0 and_last_valid
set_property -dict {CONFIG.C_SIZE 1} [get_bd_cells and_last_valid]
create_bd_cell -type ip -vlnv xilinx.com:ip:util_vector_logic:2.0 and_ready
set_property -dict {CONFIG.C_SIZE 1} [get_bd_cells and_ready]

# ---- hierarchy /rx_s ----
current_bd_instance /rx_s
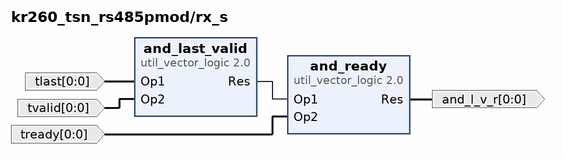
[diagram p4: block diagram inside /rx_s]
create_bd_pin -dir O -from 0 -to 0 and_l_v_r
create_bd_pin -dir I -from 0 -to 0 tlast
create_bd_pin -dir I -from 0 -to 0 tready
create_bd_pin -dir I -from 0 -to 0 tvalid

create_bd_cell -type ip -vlnv xilinx.com:ip:util_vector_logic:2.0 and_last_valid
set_property -dict {CONFIG.C_SIZE 1} [get_bd_cells and_last_valid]
create_bd_cell -type ip -vlnv xilinx.com:ip:util_vector_logic:2.0 and_ready
set_property -dict {CONFIG.C_SIZE 1} [get_bd_cells and_ready]

# ---- hierarchy /tx_b ----
current_bd_instance /tx_b
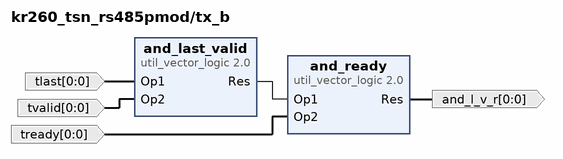
[diagram p5: block diagram inside /tx_b]
create_bd_pin -dir O -from 0 -to 0 and_l_v_r
create_bd_pin -dir I -from 0 -to 0 tlast
create_bd_pin -dir I -from 0 -to 0 tready
create_bd_pin -dir I -from 0 -to 0 tvalid

create_bd_cell -type ip -vlnv xilinx.com:ip:util_vector_logic:2.0 and_last_valid
set_property -dict {CONFIG.C_SIZE 1} [get_bd_cells and_last_valid]
create_bd_cell -type ip -vlnv xilinx.com:ip:util_vector_logic:2.0 and_ready
set_property -dict {CONFIG.C_SIZE 1} [get_bd_cells and_ready]

# ---- hierarchy /tx_s ----
current_bd_instance /tx_s
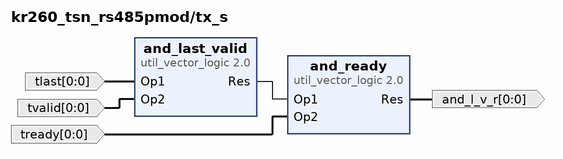
[diagram p6: block diagram inside /tx_s]
create_bd_pin -dir O -from 0 -to 0 and_l_v_r
create_bd_pin -dir I -from 0 -to 0 tlast
create_bd_pin -dir I -from 0 -to 0 tready
create_bd_pin -dir I -from 0 -to 0 tvalid

create_bd_cell -type ip -vlnv xilinx.com:ip:util_vector_logic:2.0 and_last_valid
set_property -dict {CONFIG.C_SIZE 1} [get_bd_cells and_last_valid]
create_bd_cell -type ip -vlnv xilinx.com:ip:util_vector_logic:2.0 and_ready
set_property -dict {CONFIG.C_SIZE 1} [get_bd_cells and_ready]

# ---- connections ----

current_bd_instance /rx_b
connect_bd_net -net Op2_1 [get_bd_pins tready] [get_bd_pins and_ready/Op2]
connect_bd_net [get_bd_pins and_ready/Res] [get_bd_pins and_l_v_r]
connect_bd_net -net ta_dma_0_m_axis_st_tlast [get_bd_pins tlast] [get_bd_pins and_last_valid/Op1]
connect_bd_net -net ta_dma_0_m_axis_st_tvalid [get_bd_pins tvalid] [get_bd_pins and_last_valid/Op2]
connect_bd_net -net util_vector_logic_0_Res [get_bd_pins and_last_valid/Res] [get_bd_pins and_ready/Op1]

current_bd_instance /rx_s
connect_bd_net -net Op2_1 [get_bd_pins tready] [get_bd_pins and_ready/Op2]
connect_bd_net [get_bd_pins and_ready/Res] [get_bd_pins and_l_v_r]
connect_bd_net -net ta_dma_0_m_axis_st_tlast [get_bd_pins tlast] [get_bd_pins and_last_valid/Op1]
connect_bd_net -net ta_dma_0_m_axis_st_tvalid [get_bd_pins tvalid] [get_bd_pins and_last_valid/Op2]
connect_bd_net -net util_vector_logic_0_Res [get_bd_pins and_last_valid/Res] [get_bd_pins and_ready/Op1]

current_bd_instance /tx_b
connect_bd_net -net Op2_1 [get_bd_pins tready] [get_bd_pins and_ready/Op2]
connect_bd_net [get_bd_pins and_ready/Res] [get_bd_pins and_l_v_r]
connect_bd_net -net ta_dma_0_m_axis_st_tlast [get_bd_pins tlast] [get_bd_pins and_last_valid/Op1]
connect_bd_net -net ta_dma_0_m_axis_st_tvalid [get_bd_pins tvalid] [get_bd_pins and_last_valid/Op2]
connect_bd_net -net util_vector_logic_0_Res [get_bd_pins and_last_valid/Res] [get_bd_pins and_ready/Op1]

current_bd_instance /tx_s
connect_bd_net -net Op2_1 [get_bd_pins tready] [get_bd_pins and_ready/Op2]
connect_bd_net [get_bd_pins and_ready/Res] [get_bd_pins and_l_v_r]
connect_bd_net -net ta_dma_0_m_axis_st_tlast [get_bd_pins tlast] [get_bd_pins and_last_valid/Op1]
connect_bd_net -net ta_dma_0_m_axis_st_tvalid [get_bd_pins tvalid] [get_bd_pins and_last_valid/Op2]
connect_bd_net -net util_vector_logic_0_Res [get_bd_pins and_last_valid/Res] [get_bd_pins and_ready/Op1]

current_bd_instance /
connect_bd_intf_net [get_bd_intf_pins PS_0/M_AXI_HPM0_LPD] [get_bd_intf_pins ps8_0_axi_periph/S00_AXI]
connect_bd_intf_net [get_bd_intf_pins axi_mcdma_0/M_AXIS_MM2S] [get_bd_intf_pins my_tsn_ip/tx_axis_be]
connect_bd_intf_net [get_bd_intf_pins axi_mcdma_0/M_AXI_MM2S] [get_bd_intf_pins axi_smc/S01_AXI]
connect_bd_intf_net [get_bd_intf_pins axi_mcdma_0/M_AXI_S2MM] [get_bd_intf_pins axi_smc/S02_AXI]
connect_bd_intf_net [get_bd_intf_pins axi_mcdma_0/M_AXI_SG] [get_bd_intf_pins axi_smc/S00_AXI]
connect_bd_intf_net [get_bd_intf_pins axi_smc_1/M00_AXI] [get_bd_intf_pins PS_0/S_AXI_HP1_FPD]
connect_bd_intf_net [get_bd_intf_pins axi_smc_2/M00_AXI] [get_bd_intf_pins PS_0/S_AXI_HP2_FPD]
connect_bd_intf_net [get_bd_intf_pins PS_0/S_AXI_HP0_FPD] [get_bd_intf_pins axi_smc/M00_AXI]
connect_bd_intf_net [get_bd_intf_pins axi_mcdma_0/S_AXIS_S2MM] [get_bd_intf_pins axis_switch_0/M00_AXIS]
connect_bd_intf_net [get_bd_intf_pins axis_switch_0/S01_AXIS] [get_bd_intf_pins my_tsn_ip/rx_axis_be]
connect_bd_intf_net [get_bd_intf_pins axi_mcdma_0/S_AXI_LITE] [get_bd_intf_pins ps8_0_axi_periph/M00_AXI]
connect_bd_intf_net [get_bd_intf_pins ps8_0_axi_periph/M01_AXI] [get_bd_intf_pins ta_dma_0/S_AXI]
connect_bd_intf_net [get_bd_intf_pins my_tsn_ip/s_axi] [get_bd_intf_pins ps8_0_axi_periph/M02_AXI]
connect_bd_intf_net [get_bd_intf_pins axi_intc_0/s_axi] [get_bd_intf_pins ps8_0_axi_periph/M03_AXI]
connect_bd_intf_net [get_bd_intf_pins ps8_0_axi_periph/M04_AXI] [get_bd_intf_pins axi_uartlite_1/S_AXI]
connect_bd_intf_net [get_bd_intf_pins ps8_0_axi_periph/M05_AXI] [get_bd_intf_pins test_pmod_controller_0/S00_AXI]
connect_bd_intf_net [get_bd_intf_pins ps8_0_axi_periph/M06_AXI] [get_bd_intf_pins sgemm_0/s_axi_control]
connect_bd_intf_net [get_bd_intf_pins sgemm_0/m_axi_A] [get_bd_intf_pins axi_smc_1/S00_AXI]
connect_bd_intf_net [get_bd_intf_pins sgemm_0/m_axi_B] [get_bd_intf_pins axi_smc_1/S01_AXI]
connect_bd_intf_net [get_bd_intf_pins sgemm_0/m_axi_C] [get_bd_intf_pins axi_smc_2/S00_AXI]
connect_bd_intf_net [get_bd_intf_pins axi_smc/S03_AXI] [get_bd_intf_pins ta_dma_0/M_AXI]
connect_bd_intf_net [get_bd_intf_pins my_tsn_ip/tx_axis_st] [get_bd_intf_pins ta_dma_0/M_AXIS_ST_INTF]
connect_bd_intf_net -intf_net tsn_endpoint_ethernet_mac_0_mdio_external1 [get_bd_intf_ports mdio] [get_bd_intf_pins my_tsn_ip/mdio_external1]
connect_bd_intf_net -intf_net tsn_endpoint_ethernet_mac_0_mdio_external2 [get_bd_intf_ports mdio2] [get_bd_intf_pins my_tsn_ip/mdio_external2]
connect_bd_intf_net -intf_net tsn_endpoint_ethernet_mac_0_rgmii1 [get_bd_intf_ports rgmii] [get_bd_intf_pins my_tsn_ip/rgmii1]
connect_bd_intf_net -intf_net tsn_endpoint_ethernet_mac_0_rgmii2 [get_bd_intf_ports rgmii2] [get_bd_intf_pins my_tsn_ip/rgmii2]
connect_bd_intf_net -intf_net tsn_endpoint_ethernet_mac_0_rx_axis_st [get_bd_intf_pins axis_switch_0/S00_AXIS] [get_bd_intf_pins my_tsn_ip/rx_axis_st]
connect_bd_net -net Op2_1 [get_bd_pins my_tsn_ip/tx_axis_st_tready] [get_bd_pins tx_s/tready] [get_bd_pins ta_dma_0/m_axis_st_tready]
connect_bd_net [get_bd_pins PS_0/emio_ttc0_wave_o] [get_bd_pins xlslice_ttc_0/Din]
connect_bd_net [get_bd_pins PS_0/pl_clk0] [get_bd_pins rst_PS_0_99M/slowest_sync_clk]
connect_bd_net [get_bd_pins axi_intc_0/irq] [get_bd_pins PS_0/pl_ps_irq0]
connect_bd_net [get_bd_pins axi_mcdma_0/m_axis_mm2s_tlast] [get_bd_pins tx_b/tlast] [get_bd_pins my_tsn_ip/tx_axis_be_tlast]
connect_bd_net [get_bd_pins axi_mcdma_0/m_axis_mm2s_tvalid] [get_bd_pins tx_b/tvalid] [get_bd_pins my_tsn_ip/tx_axis_be_tvalid]
connect_bd_net [get_bd_pins axi_mcdma_0/mm2s_ch1_introut] [get_bd_pins interrupts_concat_0/In1]
connect_bd_net [get_bd_pins axi_mcdma_0/mm2s_ch2_introut] [get_bd_pins interrupts_concat_0/In2]
connect_bd_net [get_bd_pins axi_mcdma_0/s2mm_ch1_introut] [get_bd_pins interrupts_concat_0/In3]
connect_bd_net [get_bd_pins axi_mcdma_0/s2mm_ch2_introut] [get_bd_pins interrupts_concat_0/In4]
connect_bd_net [get_bd_pins axi_mcdma_0/s2mm_ch3_introut] [get_bd_pins interrupts_concat_0/In5]
connect_bd_net [get_bd_pins axi_mcdma_0/s2mm_ch4_introut] [get_bd_pins interrupts_concat_0/In6]
connect_bd_net -net axi_uartlite_0_txen [get_bd_ports UART_0_rxen] [get_bd_ports UART_0_txen]
connect_bd_net [get_bd_pins axi_uartlite_1/interrupt] [get_bd_pins xlconcat_2/In2]
connect_bd_net [get_bd_pins axi_uartlite_1/tx] [get_bd_ports UART_0_txd]
connect_bd_net [get_bd_pins axis_switch_0/s_axis_tready] [get_bd_pins xlslice_trdy_0/Din] [get_bd_pins xlslice_trdy_1/Din]
connect_bd_net -net clk_in1_0_1 [get_bd_ports CLK_IN_gem] [get_bd_pins clk_wiz_0/clk_in1]
connect_bd_net [get_bd_pins clk_wiz_0/clk_out1] \
  [get_bd_pins PS_0/saxihp0_fpd_aclk] [get_bd_pins axi_mcdma_0/s_axi_aclk] [get_bd_pins axi_smc/aclk] \
  [get_bd_pins axis_switch_0/aclk] [get_bd_pins my_tsn_ip/host_txfifo_aclk] [get_bd_pins my_tsn_ip/host_rxfifo_aclk] \
  [get_bd_pins ps8_0_axi_periph/M01_ACLK] [get_bd_pins rst_clk_wiz_0_200M/slowest_sync_clk] [get_bd_pins ta_dma_0/dma_clk]
connect_bd_net [get_bd_pins clk_wiz_0/clk_out2] \
  [get_bd_pins my_tsn_ip/gtx_clk] [get_bd_pins my_tsn_ip/gtx_clk90] [get_bd_pins rst_clk_wiz_0_125M/slowest_sync_clk] \
  [get_bd_pins ta_dma_0/rtc_clk]
connect_bd_net [get_bd_pins clk_wiz_0/clk_out3] [get_bd_pins my_tsn_ip/refclk] [get_bd_pins rst_clk_wiz_0_300M/slowest_sync_clk]
connect_bd_net [get_bd_pins clk_wiz_0/clk_out4] \
  [get_bd_pins test_pmod_controller_0/s00_axi_aclk] [get_bd_pins PS_0/maxihpm0_lpd_aclk] [get_bd_pins axi_intc_0/s_axi_aclk] \
  [get_bd_pins axi_mcdma_0/s_axi_lite_aclk] [get_bd_pins my_tsn_ip/s_axi_aclk] [get_bd_pins ps8_0_axi_periph/ACLK] \
  [get_bd_pins ps8_0_axi_periph/S00_ACLK] [get_bd_pins ps8_0_axi_periph/M00_ACLK] [get_bd_pins ps8_0_axi_periph/M02_ACLK] \
  [get_bd_pins ps8_0_axi_periph/M03_ACLK] [get_bd_pins ps8_0_axi_periph/M04_ACLK] [get_bd_pins ps8_0_axi_periph/M05_ACLK] \
  [get_bd_pins rst_clk_wiz_0_100M/slowest_sync_clk] [get_bd_pins axi_uartlite_1/s_axi_aclk]
connect_bd_net [get_bd_pins clk_wiz_0/clk_out5] \
  [get_bd_pins rst_clk_wiz_0_250M/slowest_sync_clk] [get_bd_pins PS_0/saxihp1_fpd_aclk] [get_bd_pins PS_0/saxihp2_fpd_aclk] \
  [get_bd_pins axi_smc_1/aclk] [get_bd_pins axi_smc_2/aclk] [get_bd_pins sgemm_0/ap_clk] \
  [get_bd_pins ps8_0_axi_periph/M06_ACLK]
connect_bd_net [get_bd_pins clk_wiz_0/locked] \
  [get_bd_pins my_tsn_ip/gtx_dcm_locked] [get_bd_pins rst_clk_wiz_0_100M/dcm_locked] \
  [get_bd_pins rst_clk_wiz_0_125M/dcm_locked] [get_bd_pins rst_clk_wiz_0_200M/dcm_locked] \
  [get_bd_pins rst_clk_wiz_0_300M/dcm_locked] [get_bd_pins rst_clk_wiz_0_250M/dcm_locked]
connect_bd_net [get_bd_pins interrupts_concat_0/dout] [get_bd_pins xlconcat_2/In1]
connect_bd_net [get_bd_pins interrupts_concat_1/dout] [get_bd_pins xlconcat_2/In0]
connect_bd_net [get_bd_pins my_tsn_ip/ptp_timers_clk8k] [get_bd_ports ptp_timer] [get_bd_pins proc_sys_reset_0/slowest_sync_clk]
connect_bd_net [get_bd_pins my_tsn_ip/rx_axis_be_tlast] [get_bd_pins rx_b/tlast] [get_bd_pins xlconcat_tlast/In1]
connect_bd_net [get_bd_pins my_tsn_ip/rx_axis_be_tvalid] [get_bd_pins rx_b/tvalid] [get_bd_pins xlconcat_tvld/In1]
connect_bd_net [get_bd_pins my_tsn_ip/rx_axis_st_tlast] [get_bd_pins rx_s/tlast] [get_bd_pins xlconcat_tlast/In0]
connect_bd_net [get_bd_pins my_tsn_ip/rx_axis_st_tvalid] [get_bd_pins rx_s/tvalid] [get_bd_pins xlconcat_tvld/In0]
connect_bd_net [get_bd_pins my_tsn_ip/tx_axis_be_tready] [get_bd_pins tx_b/tready] [get_bd_pins axi_mcdma_0/m_axis_mm2s_tready]
connect_bd_net -net rst_clk_wiz_0_100M_1_peripheral_aresetn [get_bd_pins rst_clk_wiz_0_100M/peripheral_aresetn] \
  [get_bd_pins test_pmod_controller_0/s00_axi_aresetn] [get_bd_pins axi_intc_0/s_axi_aresetn] \
  [get_bd_pins axi_mcdma_0/axi_resetn] [get_bd_pins my_tsn_ip/glbl_rstn] [get_bd_pins my_tsn_ip/s_axi_aresetn] \
  [get_bd_pins ps8_0_axi_periph/ARESETN] [get_bd_pins ps8_0_axi_periph/S00_ARESETN] \
  [get_bd_pins ps8_0_axi_periph/M00_ARESETN] [get_bd_pins ps8_0_axi_periph/M02_ARESETN] \
  [get_bd_pins ps8_0_axi_periph/M03_ARESETN] [get_bd_pins ps8_0_axi_periph/M04_ARESETN] \
  [get_bd_pins ps8_0_axi_periph/M05_ARESETN] [get_bd_pins ta_dma_0/global_resetn] [get_bd_pins axi_uartlite_1/s_axi_aresetn]
connect_bd_net -net rst_clk_wiz_0_100M_peripheral_aresetn [get_bd_pins rst_clk_wiz_0_200M/peripheral_aresetn] \
  [get_bd_pins axi_smc/aresetn] [get_bd_pins axis_switch_0/aresetn] [get_bd_pins ps8_0_axi_periph/M01_ARESETN]
connect_bd_net [get_bd_pins rst_clk_wiz_0_250M/peripheral_aresetn] \
  [get_bd_pins sgemm_0/ap_rst_n] [get_bd_pins axi_smc_1/aresetn] [get_bd_pins axi_smc_2/aresetn] \
  [get_bd_pins ps8_0_axi_periph/M06_ARESETN]
connect_bd_net -net rx_0_1 [get_bd_ports UART_0_rxd] [get_bd_pins axi_uartlite_1/rx]
connect_bd_net [get_bd_pins rx_b/and_l_v_r] [get_bd_pins test_pmod_controller_0/in_rx_b]
connect_bd_net [get_bd_pins rx_s/and_l_v_r] [get_bd_pins test_pmod_controller_0/in_rx_s]
connect_bd_net [get_bd_pins sgemm_0/interrupt] [get_bd_pins xlconcat_2/In3]
connect_bd_net [get_bd_pins ta_dma_0/introut] [get_bd_pins interrupts_concat_0/In0]
connect_bd_net [get_bd_pins ta_dma_0/m_axis_st_tlast] [get_bd_pins tx_s/tlast] [get_bd_pins my_tsn_ip/tx_axis_st_tlast]
connect_bd_net [get_bd_pins ta_dma_0/m_axis_st_tvalid] [get_bd_pins tx_s/tvalid] [get_bd_pins my_tsn_ip/tx_axis_st_tvalid]
connect_bd_net -net test_pmod_controller_0_listner_0 [get_bd_pins test_pmod_controller_0/lis1_rxs] [get_bd_ports l1_rxs]
connect_bd_net -net test_pmod_controller_0_listner_1 [get_bd_pins test_pmod_controller_0/lis2_rxb] [get_bd_ports l2_rxb]
connect_bd_net -net test_pmod_controller_0_listner_2 [get_bd_pins test_pmod_controller_0/lis3_rxx] [get_bd_ports l3_rxx]
connect_bd_net -net test_pmod_controller_0_publisher_0 [get_bd_pins test_pmod_controller_0/pub1_txs] [get_bd_ports p1_txs]
connect_bd_net -net test_pmod_controller_0_publisher_1 [get_bd_pins test_pmod_controller_0/pub2_txb] [get_bd_ports p2_txb]
connect_bd_net -net test_pmod_controller_0_publisher_2 [get_bd_pins test_pmod_controller_0/pub3_txx] [get_bd_ports p3_txx]
connect_bd_net -net tready_Res [get_bd_pins tx_s/and_l_v_r] [get_bd_pins test_pmod_controller_0/in_tx_s]
connect_bd_net -net tsn_endpoint_ethernet_mac_0_ep_tadma_if_ep_tadma_if_out [get_bd_pins my_tsn_ip/ep_tadma_if_out] \
  [get_bd_pins xlslice_12/Din] [get_bd_pins xlslice_13/Din] [get_bd_pins xlslice_14/Din] [get_bd_pins xlslice_15/Din] \
  [get_bd_pins xlslice_16/Din]
connect_bd_net -net tsn_endpoint_ethernet_mac_0_interrupt_ptp_rx_1 [get_bd_pins my_tsn_ip/interrupt_ptp_rx_1] [get_bd_pins interrupts_concat_1/In0]
connect_bd_net -net tsn_endpoint_ethernet_mac_0_interrupt_ptp_rx_2 [get_bd_pins my_tsn_ip/interrupt_ptp_rx_2] [get_bd_pins interrupts_concat_1/In1]
connect_bd_net -net tsn_endpoint_ethernet_mac_0_interrupt_ptp_timer [get_bd_pins my_tsn_ip/interrupt_ptp_timer] [get_bd_pins interrupts_concat_1/In6]
connect_bd_net -net tsn_endpoint_ethernet_mac_0_interrupt_ptp_tx_1 [get_bd_pins my_tsn_ip/interrupt_ptp_tx_1] [get_bd_pins interrupts_concat_1/In2]
connect_bd_net -net tsn_endpoint_ethernet_mac_0_interrupt_ptp_tx_2 [get_bd_pins my_tsn_ip/interrupt_ptp_tx_2] [get_bd_pins interrupts_concat_1/In3]
connect_bd_net -net tsn_endpoint_ethernet_mac_0_mac_irq_1 [get_bd_pins my_tsn_ip/mac_irq_1] [get_bd_pins interrupts_concat_1/In4]
connect_bd_net -net tsn_endpoint_ethernet_mac_0_mac_irq_2 [get_bd_pins my_tsn_ip/mac_irq_2] [get_bd_pins interrupts_concat_1/In5]
connect_bd_net -net tsn_endpoint_ethernet_mac_0_ptp_timers_syntonised_nanosec_field [get_bd_pins my_tsn_ip/ptp_timers_syntonised_nanosec_field] \
  [get_bd_pins xlconcat_7/In0]
connect_bd_net -net tsn_endpoint_ethernet_mac_0_ptp_timers_syntonised_sec_field [get_bd_pins my_tsn_ip/ptp_timers_syntonised_sec_field] \
  [get_bd_pins xlconcat_7/In1]
connect_bd_net -net tsn_endpoint_ethernet_mac_0_rtc_nanosec_field [get_bd_pins my_tsn_ip/ptp_timers_ns_field] \
  [get_bd_pins xlslice_10/Din] [get_bd_pins xlslice_11/Din] [get_bd_pins xlslice_7/Din] [get_bd_pins xlslice_8/Din] \
  [get_bd_pins xlslice_9/Din]
connect_bd_net -net tsn_endpoint_ethernet_mac_0_rtc_sec_field [get_bd_pins my_tsn_ip/ptp_timers_s_field] [get_bd_pins xlslice_6/Din]
connect_bd_net -net tsn_endpoint_ethernet_mac_0_tsn_debug_hooks [get_bd_pins my_tsn_ip/misc_out_tsn_debug_hooks] \
  [get_bd_pins xlslice_1/Din] [get_bd_pins xlslice_2/Din] [get_bd_pins xlslice_3/Din] [get_bd_pins xlslice_4/Din] \
  [get_bd_pins xlslice_5/Din]
connect_bd_net -net tsn_endpoint_ethernet_mac_0_tsn_ep_scheduler_irq [get_bd_pins my_tsn_ip/tsn_ep_scheduler_irq] \
  [get_bd_pins interrupts_concat_1/In7]
connect_bd_net [get_bd_pins tx_b/and_l_v_r] [get_bd_pins test_pmod_controller_0/in_tx_b]
connect_bd_net -net xlconcat_0_dout [get_bd_pins xlconcat_tlast/dout] [get_bd_pins axis_switch_0/s_axis_tlast]
connect_bd_net -net xlconcat_1_dout [get_bd_pins xlconcat_tvld/dout] [get_bd_pins axis_switch_0/s_axis_tvalid]
connect_bd_net [get_bd_pins xlconcat_2/dout] [get_bd_pins axi_intc_0/intr]
connect_bd_net [get_bd_pins xlconcat_7/dout] [get_bd_pins ta_dma_0/current_time]
connect_bd_net [get_bd_pins xlconstant_0/dout] [get_bd_ports Phy_reset_n]
connect_bd_net [get_bd_pins xlconstant_1/dout] [get_bd_pins test_pmod_controller_0/in_rx_x] [get_bd_pins test_pmod_controller_0/in_tx_x]
connect_bd_net [get_bd_pins xlconstant_2/dout] [get_bd_pins axis_switch_0/s_req_suppress]
connect_bd_net [get_bd_pins xlconstant_4/dout] [get_bd_pins ta_dma_0/m_axis_res_tready] [get_bd_pins ta_dma_0/m_axis_be_tready]
connect_bd_net -net xlslice_0_Dout [get_bd_pins PS_0/pl_resetn0] \
  [get_bd_pins proc_sys_reset_0/ext_reset_in] [get_bd_pins rst_clk_wiz_0_100M/ext_reset_in] \
  [get_bd_pins rst_clk_wiz_0_125M/ext_reset_in] [get_bd_pins rst_clk_wiz_0_200M/ext_reset_in] \
  [get_bd_pins rst_clk_wiz_0_300M/ext_reset_in] [get_bd_pins rst_clk_wiz_0_250M/ext_reset_in] \
  [get_bd_pins rst_PS_0_99M/ext_reset_in]
connect_bd_net -net xlslice_0_Dout1 [get_bd_pins xlslice_trdy_0/Dout] [get_bd_pins rx_s/tready] [get_bd_pins my_tsn_ip/rx_axis_st_tready]
connect_bd_net [get_bd_pins xlslice_12/Dout] [get_bd_pins ta_dma_0/st_byte_space_in_fifo]
connect_bd_net [get_bd_pins xlslice_13/Dout] [get_bd_pins ta_dma_0/new_schedule_start]
connect_bd_net [get_bd_pins xlslice_14/Dout] [get_bd_pins ta_dma_0/re_byte_space_in_fifo]
connect_bd_net [get_bd_pins xlslice_15/Dout] [get_bd_pins ta_dma_0/be_byte_space_in_fifo]
connect_bd_net [get_bd_pins xlslice_16/Dout] [get_bd_pins ta_dma_0/cycle_start]
connect_bd_net -net xlslice_17_Dout [get_bd_pins xlslice_trdy_1/Dout] [get_bd_pins rx_b/tready] [get_bd_pins my_tsn_ip/rx_axis_be_tready]
connect_bd_net [get_bd_pins xlslice_ttc_0/Dout] [get_bd_ports fan_en_b]
set_property PFM.AXI_PORT {M_AXI_HPM0_FPD { memport "M_AXI_GP" sptag "" memory "" is_range "false" } S_AXI_HPC0_FPD { memport "S_AXI_HP" sptag "HPC0" memory "PS_0 HPC0_DDR_LOW" is_range "false" } S_AXI_HPC1_FPD { memport "S_AXI_HP" sptag "HPC1" memory "PS_0 HPC1_DDR_LOW" is_range "false" } S_AXI_LPD { memport "MIG" sptag "LPD" memory "PS_0 LPD_DDR_LOW" is_range "false" } } [get_bd_cells PS_0]
set_property PFM.IRQ {pl_ps_irq1 {id 0 range 7}} [get_bd_cells PS_0]
set_property PFM.CLOCK {clk_out1 {id "0" is_default "true" proc_sys_reset "/rst_clk_wiz_0_200M" status "fixed" freq_hz "200000000"} clk_out2 {id "1" is_default "false" proc_sys_reset "/rst_clk_wiz_0_125M" status "fixed" freq_hz "125000000"} clk_out3 {id "2" is_default "false" proc_sys_reset "/rst_clk_wiz_0_300M" status "fixed" freq_hz "300000000"} clk_out4 {id "3" is_default "false" proc_sys_reset "/rst_clk_wiz_0_100M" status "fixed" freq_hz "100000000"}} [get_bd_cells clk_wiz_0]

# ---- address map ----
assign_bd_address -offset 0x00000000 -range 2G -target_address_space [get_bd_addr_spaces axi_mcdma_0/Data_MM2S] [get_bd_addr_segs PS_0/SAXIGP2/HP0_DDR_LOW]
assign_bd_address -offset 0xC0000000 -range 512M -target_address_space [get_bd_addr_spaces axi_mcdma_0/Data_MM2S] [get_bd_addr_segs PS_0/SAXIGP2/HP0_QSPI]
exclude_bd_addr_seg -offset 0x00000000 -range 1 -target_address_space [get_bd_addr_spaces axi_mcdma_0/Data_MM2S] [get_bd_addr_segs PS_0/SAXIGP2/HP0_DDR_HIGH]
exclude_bd_addr_seg -offset 0xFF000000 -range 16M -target_address_space [get_bd_addr_spaces axi_mcdma_0/Data_MM2S] [get_bd_addr_segs PS_0/SAXIGP2/HP0_LPS_OCM]
assign_bd_address -offset 0x00000000 -range 2G -target_address_space [get_bd_addr_spaces axi_mcdma_0/Data_S2MM] [get_bd_addr_segs PS_0/SAXIGP2/HP0_DDR_LOW]
assign_bd_address -offset 0xC0000000 -range 512M -target_address_space [get_bd_addr_spaces axi_mcdma_0/Data_S2MM] [get_bd_addr_segs PS_0/SAXIGP2/HP0_QSPI]
exclude_bd_addr_seg -offset 0x00000000 -range 1 -target_address_space [get_bd_addr_spaces axi_mcdma_0/Data_S2MM] [get_bd_addr_segs PS_0/SAXIGP2/HP0_DDR_HIGH]
exclude_bd_addr_seg -offset 0xFF000000 -range 16M -target_address_space [get_bd_addr_spaces axi_mcdma_0/Data_S2MM] [get_bd_addr_segs PS_0/SAXIGP2/HP0_LPS_OCM]
assign_bd_address -offset 0x00000000 -range 2G -target_address_space [get_bd_addr_spaces axi_mcdma_0/Data_SG] [get_bd_addr_segs PS_0/SAXIGP2/HP0_DDR_LOW]
assign_bd_address -offset 0xC0000000 -range 512M -target_address_space [get_bd_addr_spaces axi_mcdma_0/Data_SG] [get_bd_addr_segs PS_0/SAXIGP2/HP0_QSPI]
exclude_bd_addr_seg -offset 0x00000000 -range 1 -target_address_space [get_bd_addr_spaces axi_mcdma_0/Data_SG] [get_bd_addr_segs PS_0/SAXIGP2/HP0_DDR_HIGH]
exclude_bd_addr_seg -offset 0xFF000000 -range 16M -target_address_space [get_bd_addr_spaces axi_mcdma_0/Data_SG] [get_bd_addr_segs PS_0/SAXIGP2/HP0_LPS_OCM]
assign_bd_address -offset 0x0080000000 -range 256K -target_address_space [get_bd_addr_spaces PS_0/Data] [get_bd_addr_segs my_tsn_ip/s_axi/Reg]
assign_bd_address -offset 0x0080040000 -range 64K -target_address_space [get_bd_addr_spaces PS_0/Data] [get_bd_addr_segs axi_intc_0/S_AXI/Reg]
assign_bd_address -offset 0x0080050000 -range 64K -target_address_space [get_bd_addr_spaces PS_0/Data] [get_bd_addr_segs axi_mcdma_0/S_AXI_LITE/Reg]
assign_bd_address -offset 0x0080060000 -range 64K -target_address_space [get_bd_addr_spaces PS_0/Data] [get_bd_addr_segs axi_uartlite_1/S_AXI/Reg]
assign_bd_address -offset 0x0080070000 -range 64K -target_address_space [get_bd_addr_spaces PS_0/Data] [get_bd_addr_segs sgemm_0/s_axi_control/Reg]
assign_bd_address -offset 0x0080080000 -range 64K -target_address_space [get_bd_addr_spaces PS_0/Data] [get_bd_addr_segs ta_dma_0/S_AXI/Reg]
assign_bd_address -offset 0x0080090000 -range 64K -target_address_space [get_bd_addr_spaces PS_0/Data] [get_bd_addr_segs test_pmod_controller_0/S00_AXI/S00_AXI_reg]
assign_bd_address -offset 0x0000000000000000 -range 2G -target_address_space [get_bd_addr_spaces sgemm_0/Data_m_axi_A] [get_bd_addr_segs PS_0/SAXIGP3/HP1_DDR_LOW]
assign_bd_address -offset 0x00000000C0000000 -range 512M -target_address_space [get_bd_addr_spaces sgemm_0/Data_m_axi_A] [get_bd_addr_segs PS_0/SAXIGP3/HP1_QSPI]
assign_bd_address -offset 0x0000000800000000 -range 32G -target_address_space [get_bd_addr_spaces sgemm_0/Data_m_axi_A] [get_bd_addr_segs PS_0/SAXIGP3/HP1_DDR_HIGH]
exclude_bd_addr_seg -offset 0x00000000FF000000 -range 16M -target_address_space [get_bd_addr_spaces sgemm_0/Data_m_axi_A] [get_bd_addr_segs PS_0/SAXIGP3/HP1_LPS_OCM]
assign_bd_address -offset 0x0000000000000000 -range 2G -target_address_space [get_bd_addr_spaces sgemm_0/Data_m_axi_B] [get_bd_addr_segs PS_0/SAXIGP3/HP1_DDR_LOW]
assign_bd_address -offset 0x00000000C0000000 -range 512M -target_address_space [get_bd_addr_spaces sgemm_0/Data_m_axi_B] [get_bd_addr_segs PS_0/SAXIGP3/HP1_QSPI]
assign_bd_address -offset 0x0000000800000000 -range 32G -target_address_space [get_bd_addr_spaces sgemm_0/Data_m_axi_B] [get_bd_addr_segs PS_0/SAXIGP3/HP1_DDR_HIGH]
exclude_bd_addr_seg -offset 0x00000000FF000000 -range 16M -target_address_space [get_bd_addr_spaces sgemm_0/Data_m_axi_B] [get_bd_addr_segs PS_0/SAXIGP3/HP1_LPS_OCM]
assign_bd_address -offset 0x0000000000000000 -range 2G -target_address_space [get_bd_addr_spaces sgemm_0/Data_m_axi_C] [get_bd_addr_segs PS_0/SAXIGP4/HP2_DDR_LOW]
assign_bd_address -offset 0x00000000C0000000 -range 512M -target_address_space [get_bd_addr_spaces sgemm_0/Data_m_axi_C] [get_bd_addr_segs PS_0/SAXIGP4/HP2_QSPI]
assign_bd_address -offset 0x0000000800000000 -range 32G -target_address_space [get_bd_addr_spaces sgemm_0/Data_m_axi_C] [get_bd_addr_segs PS_0/SAXIGP4/HP2_DDR_HIGH]
exclude_bd_addr_seg -offset 0x00000000FF000000 -range 16M -target_address_space [get_bd_addr_spaces sgemm_0/Data_m_axi_C] [get_bd_addr_segs PS_0/SAXIGP4/HP2_LPS_OCM]
assign_bd_address -offset 0x0000000000 -range 2G -target_address_space [get_bd_addr_spaces ta_dma_0/Data] [get_bd_addr_segs PS_0/SAXIGP2/HP0_DDR_LOW]
assign_bd_address -offset 0x00C0000000 -range 512M -target_address_space [get_bd_addr_spaces ta_dma_0/Data] [get_bd_addr_segs PS_0/SAXIGP2/HP0_QSPI]
assign_bd_address -offset 0x0800000000 -range 32G -target_address_space [get_bd_addr_spaces ta_dma_0/Data] [get_bd_addr_segs PS_0/SAXIGP2/HP0_DDR_HIGH]
exclude_bd_addr_seg -offset 0x00FF000000 -range 16M -target_address_space [get_bd_addr_spaces ta_dma_0/Data] [get_bd_addr_segs PS_0/SAXIGP2/HP0_LPS_OCM]

validate_bd_design
save_bd_design
